# EAGLE schematic stm32hw05 (EAGLE 6.6.0)
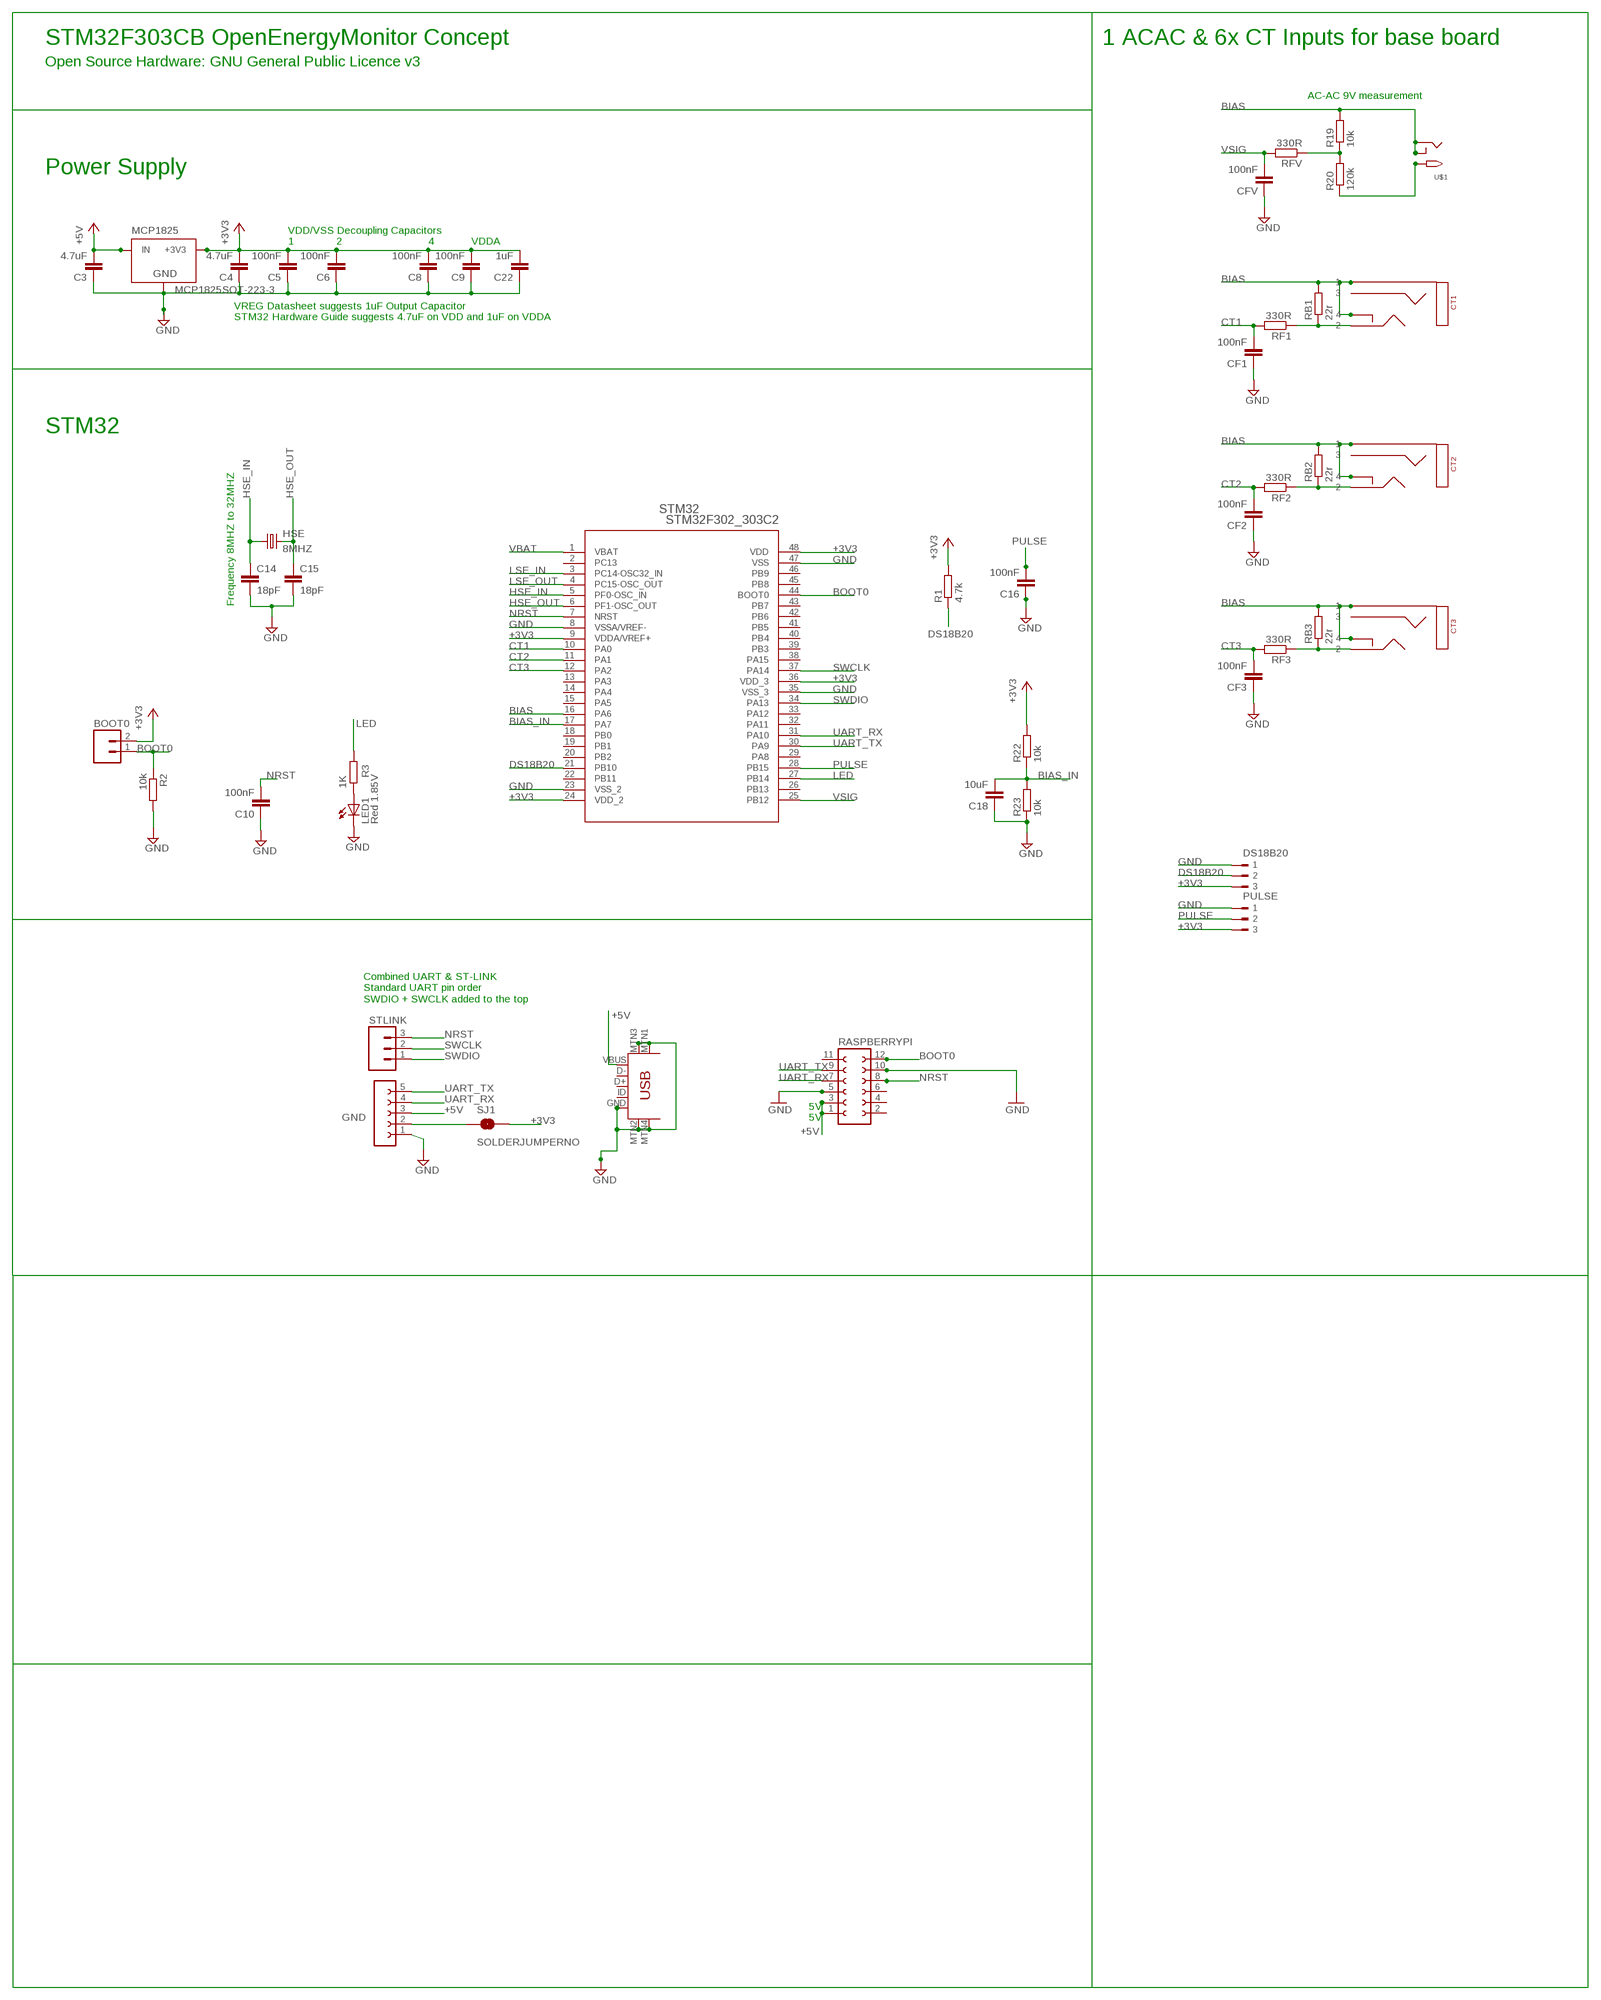
[diagram p0: schematic, sheet 1]

## Parts
BOOT0  M02PTH  [1X02]
C3  4.7uF  C-EUC0603  [C0603]
C4  4.7uF  C-EUC0603  [C0603]
C5  100nF  C-EUC0603  [C0603]
C6  100nF  C-EUC0603  [C0603]
C8  100nF  C-EUC0603  [C0603]
C9  100nF  C-EUC0603  [C0603]
C10  100nF  C-EUC0603  [C0603]
C14  18pF  C-EUC0603  [C0603]
C15  18pF  C-EUC0603  [C0603]
C16  100nF  C-EUC0603  [C0603]
C18  10uF  C-EUC0603  [C0603]
C22  1uF  C-EUC0603  [C0603]
CF1  100nF  C-EUC0603  [C0603]
CF2  100nF  C-EUC0603  [C0603]
CF3  100nF  C-EUC0603  [C0603]
CFV  100nF  C-EUC0603  [C0603]
CT1  STEREO_SMD  [STEREO_SMT]
CT2  STEREO_SMD  [STEREO_SMT]
CT3  STEREO_SMD  [STEREO_SMT]
DS18B20  180-3  [180-3]
GND  UART  FE05-1  [FE05-1]
HSE  8MHZ  CRYSTALCTS406  [CTS406]
LED1  Red 1.85V  LEDCHIP-LED0805  [CHIP-LED0805]
MCP1825  MCP1825SOT-223-3  [SOT-223]
PULSE  180-3  [180-3]
R1  4.7k  R-EU_R0603  [R0603]
R2  10k  R-EU_R0603  [R0603]
R3  1K  R-EU_R0603  [R0603]
R19  10k  R-EU_R0603  [R0603]
R20  120k  R-EU_R0603  [R0603]
R22  10k  R-EU_R0603  [R0603]
R23  10k  R-EU_R0603  [R0603]
RASPBERRYPI  FE06-2  [FE06-2]
RB1  22r  R-EU_R0603  [R0603]
RB2  22r  R-EU_R0603  [R0603]
RB3  22r  R-EU_R0603  [R0603]
RF1  330R  R-EU_R0603  [R0603]
RF2  330R  R-EU_R0603  [R0603]
RF3  330R  R-EU_R0603  [R0603]
RFV  330R  R-EU_R0603  [R0603]
SJ1  SOLDERJUMPERNO  [SJ_2S-NO]
STLINK  M03PTH  [1X03]
STM32  STM32F302_303C2  [LQFP48-7X7MM]
U$1  2.1MMJACKSMT  [DCJACK_2MM_SMT]
U$10  USB-MINIB-5PIN  [USB-MINIB-CISECO]

## Nets
+3V3: BOOT0.2 C4.2 C5.2 C6.2 C8.2 C9.2 C22.2 DS18B20.3 MCP1825.3(+3V3) PULSE.3 R1.2 R22.2 SJ1.2 STM32.9(VDDA/VREF+) STM32.24(VDD_2) STM32.36(VDD_3) STM32.48(VDD)
+5V: C3.2 GND.3 MCP1825.1(IN) RASPBERRYPI.1 RASPBERRYPI.3 U$10.VBUS
AC: R20.1 U$1.PWR2(TIP)
ADC0: R19.1 R20.2 RFV.1
BIAS: CT1.P$1 CT1.P$4 CT2.P$1 CT2.P$4 CT3.P$1 CT3.P$4 R19.2 RB1.2 RB2.2 RB3.2 STM32.16(PA6) U$1.GND(RING) U$1.GNDBREAK(RING_SW)
BIAS_IN: C18.2 R22.1 R23.2 STM32.17(PA7)
BOOT0: BOOT0.1 R2.1 RASPBERRYPI.12 STM32.44(BOOT0)
CT1: CF1.2 RF1.2 STM32.10(PA0)
CT2: CF2.2 RF2.2 STM32.11(PA1)
CT3: CF3.2 RF3.2 STM32.12(PA2)
DS18B20: DS18B20.2 R1.1 STM32.21(PB10)
GND: C3.1 C4.1 C5.1 C6.1 C8.1 C9.1 C10.1 C14.2 C15.2 C16.1 C18.1 C22.1 CF1.1 CF2.1 CF3.1 CFV.1 DS18B20.1 GND.1 LED1.C MCP1825.2(GND) PULSE.1 R2.2 R23.1 RASPBERRYPI.5 RASPBERRYPI.10 STM32.8(VSSA/VREF-) STM32.23(VSS_2) STM32.35(VSS_3) STM32.47(VSS) U$10.GND U$10.MTN1(MTN2) U$10.MTN2(MTN3) U$10.MTN3(MTN1) U$10.MTN4
HSE_IN: C14.1 HSE.1 STM32.5(PF0-OSC_IN)
HSE_OUT: C15.1 HSE.3 STM32.6(PF1-OSC_OUT)
LED: R3.2 STM32.27(PB14)
LSE_IN: STM32.3(PC14-OSC32_IN)
LSE_OUT: STM32.4(PC15-OSC_OUT)
N$1: GND.2 SJ1.1
N$2: CT1.P$2 RB1.1 RF1.1
N$8: CT2.P$2 RB2.1 RF2.1
N$10: CT3.P$2 RB3.1 RF3.1
N$41: LED1.A R3.1
NRST: C10.2 RASPBERRYPI.8 STLINK.3 STM32.7(NRST)
PULSE: C16.2 PULSE.2 STM32.28(PB15)
SWCLK: STLINK.2 STM32.37(PA14)
SWDIO: STLINK.1 STM32.34(PA13)
UART_RX: GND.4 RASPBERRYPI.7 STM32.31(PA10)
UART_TX: GND.5 RASPBERRYPI.9 STM32.30(PA9)
VBAT: STM32.1(VBAT)
VSIG: CFV.2 RFV.2 STM32.25(PB12)
Unconnected: CT1.P$3 CT2.P$3 CT3.P$3 RASPBERRYPI.2 RASPBERRYPI.4 RASPBERRYPI.6 RASPBERRYPI.11 STM32.2(PC13) STM32.13(PA3) STM32.14(PA4) STM32.15(PA5) STM32.18(PB0) STM32.19(PB1) STM32.20(PB2) STM32.22(PB11) STM32.26(PB13) STM32.29(PA8) STM32.32(PA11) STM32.33(PA12) STM32.38(PA15) STM32.39(PB3) STM32.40(PB4) STM32.41(PB5) STM32.42(PB6) STM32.43(PB7) STM32.45(PB8) STM32.46(PB9) U$10.D+ U$10.D- U$10.ID

## Notes on the sheet
- STM32F303CB OpenEnergyMonitor Concept | 1 ACAC & 6x CT Inputs for base board
- Open Source Hardware: GNU General Public Licence v3
- AC-AC 9V measurement
- Power Supply
- VDD/VSS Decoupling Capacitors
- 1 | 2 | 4 | VDDA
- VREG Datasheet suggests 1uF Output Capacitor
- STM32 Hardware Guide suggests 4.7uF on VDD and 1uF on VDDA
- STM32
- Frequency 8MHZ to 32MHZ
- Combined UART & ST-LINK
  Standard UART pin order
  SWDIO + SWCLK added to the top
- 5V
- 5V

## Library data of the parts
BOOT0 = SparkFun:M02: Header 2 Standard 2-pin 0.1" header. Use with straight break away headers (SKU : PRT-00116), right angle break away headers (PRT-00553), swiss pins (PRT-00743), machine pins (PRT-00117), and female headers (PRT-00115). Molex polarized connector foot print use with SKU : PRT-08233 with associated crimp pins and housings.
C3-C6 C8-C10 C14-C16 C18 C22 CF1-CF3 CFV = resistor:C-EU: CAPACITOR, European symbol
CT1-CT3 = IotaWatt_parts:STEREO_SMD: 3.5mm Stereo Jack SMT
DS18B20 PULSE = con-weidmueller-sl35:180-3: WEIDMUELLER CLAMP CONNECTOR; OC_FARNELL: unknown; OC_NEWARK: unknown
GND = con-lsta:FE05-1: FEMALE HEADER; OC_FARNELL: unknown; OC_NEWARK: unknown
HSE = crystal:CRYSTAL: CRYSTAL; OC_FARNELL: unknown; OC_NEWARK: unknown
LED1 = adafruit:LED: LED OSRAM: - CHIPLED LG R971, LG N971, LY N971, LG Q971, LY Q971, LO R971, LY R971 LH N974, LH R974 LS Q976, LO Q976, LY Q976 LO Q996 - Hyper CHIPLED LW Q18S LB Q993, LB Q99A, LB R99A - SideLED LS A670, LO A670, LY A670, LG A670, LP A670 LB A673, LV A673, LT A673, LW A673 LH A674 LY A675 LS A676, LA A676, LO A676, LY A676, LW A676 LS A679, LY A679, LG A679 - Hyper Micro SIDELED® LS Y876, LA Y876, LO Y876, LY Y876 LT Y87S - SmartLED LW L88C, LW L88S LB L89C, LB L89S, LG L890 LS L89K, LO L89K, LY L89K LS L896, LA L896, LO L896, LY L896 - TOPLED LS T670, LO T670, LY T670, LG T670, LP T670 LSG T670, LSP T670, LSY T670, LOP T670, LYG T670 LG T671, LOG T671, LSG T671 LB T673, LV T673, LT T673, LW T673 LH T674 LS T676, LA T676, LO T676, LY T676, LB T676, LH T676, LSB T676, LW T676 LB T67C, LV T67C, LT T67C, LS T67K, LO T67K, LY T67K, LW E67C LS E67B, LA E67B, LO E67B, LY E67B, LB E67C, LV E67C, LT E67C LW T67C LS T679, LY T679, LG T679 LS T770, LO T770, LY T770, LG T770, LP T770 LB T773, LV T773, LT T773, LW T773 LH T774 LS E675, LA E675, LY E675, LS T675 LS T776, LA T776, LO T776, LY T776, LB T776 LHGB T686 LT T68C, LB T68C - Hyper Mini TOPLED® LB M676 - Mini TOPLED Santana® LG M470 LS M47K, LO M47K, LY M47K Source: http://www.osram.convergy.de/
MCP1825 = SteelCaveRobotics-Power:MCP1825: MCP1825 3.3v LDO Linear Regulator
R1 R2 R19 R20 R22 R23 RB1-RB3 RF1-RF3 RFV = resistor:R-EU_: RESISTOR, European symbol
R3 = rcl:R-EU_: RESISTOR, European symbol
RASPBERRYPI = con-lsta:FE06-2: FEMALE HEADER; OC_FARNELL: unknown; OC_NEWARK: unknown
SJ1 = SparkFun:SOLDERJUMPER: Solder Jumper Standard SMD solder jumper. Used to automate production. Two varients : Normally Open and Normally Closed are the same, but have different paste layers. NC will have a large amount of paste and should jumper during reflow.
STLINK = SparkFun:M03: Header 3 Standard 3-pin 0.1" header. Use with straight break away headers (SKU : PRT-00116), right angle break away headers (PRT-00553), swiss pins (PRT-00743), machine pins (PRT-00117), and female headers (PRT-00115). Molex polarized connector foot print use with SKU : PRT-08232 with associated crimp pins and housings.
STM32 = stm32f303cb:STM32F302_303C2; MANUFACTURER_PART_NUMBER: stm32f302_303c2; VENDOR: STMicroelectronics
U$1 = adafruit:2.1MMJACK: 2.1mm x 5.5mm THM DC jack with internal switch. Digikey part #PJ-102A, 4UCON part #05537 2.1mm x 5.5mm SMT DC jack with internal switch. Digikey part #PJ-002A-SMT, 4UCON part #03267 By microbuilder.eu & adafruit.com
U$10 = Ciseco USB miniB_Updated:USB-MINIB: Mini-USB "B" connector with 5th pin broken out. Created new symbol breaking out 5th "ID" pin in mini/micro USB connector spec. See: http://en.wikipedia.org/wiki/Mini_usb#Cables. Uses same footprint as 4-pin symbol. Also added pins to connect to mounting / shield pads if required (probably not generally needed as signals aren't shielded once they leave the connector). Modified by Ciseco for Rapid Part 24-0357

## Net classes
0 default: width 0.203 mm, drill 0.6 mm, clearance 0.203 mm
1 power: width 0.381 mm, drill 0.6 mm, clearance 0.254 mm
2 gnd: width 0.254 mm, drill 0.6 mm, clearance 0.254 mm